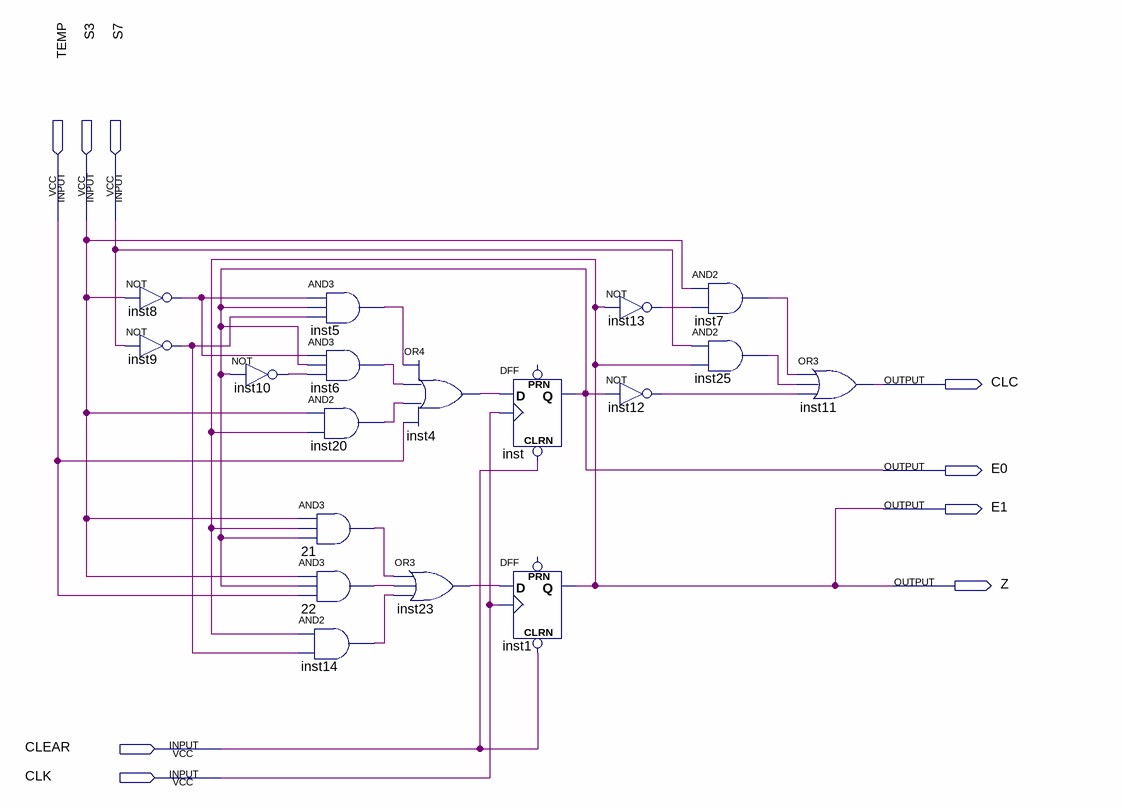
[diagram p0: schematic sheet]
// Quartus schematic mef.bdf as structural Verilog: 18 symbols, 9 pins
module mef (
  input  TEMP,
  input  S3,
  input  S7,
  input  CLEAR,
  input  CLK,
  output CLC,
  output E0,
  output E1,
  output Z
);

  wire inst4_out, inst5_out, inst6_out, inst7_out, inst8_out, inst9_out, inst10_out, inst12_out, inst13_out,
       inst14_out, inst20_out, inst23_out, inst25_out, n21_out, n22_out;

  not inst8 (inst8_out, S3);
  not inst9 (inst9_out, S7);
  not inst10 (inst10_out, E0);
  and inst5 (inst5_out, inst8_out, E0, inst9_out);
  and inst6 (inst6_out, inst8_out, E0, inst10_out);
  and inst20 (inst20_out, S3, E1);
  and u_21 (n21_out, S3, E1, E0);
  and u_22 (n22_out, S3, E0, TEMP);
  and inst14 (inst14_out, E1, inst9_out);
  or inst4 (inst4_out, inst5_out, inst6_out, inst20_out, TEMP);
  or inst23 (inst23_out, n21_out, n22_out, inst14_out);
  DFF inst (.CLRN(CLEAR), .CLK(CLK), .D(inst4_out), .Q(E0));  // open: PRN
  DFF inst1 (.CLRN(CLEAR), .CLK(CLK), .D(inst23_out), .Q(E1));  // open: PRN
  not inst13 (inst13_out, E1);
  not inst12 (inst12_out, E0);
  and inst7 (inst7_out, S3, inst13_out);
  and inst25 (inst25_out, S7, E1);
  or inst11 (CLC, inst7_out, inst25_out, inst12_out);

  assign Z = E1;
endmodule
